# EAGLE design motion_game (EAGLE 8.6.0)
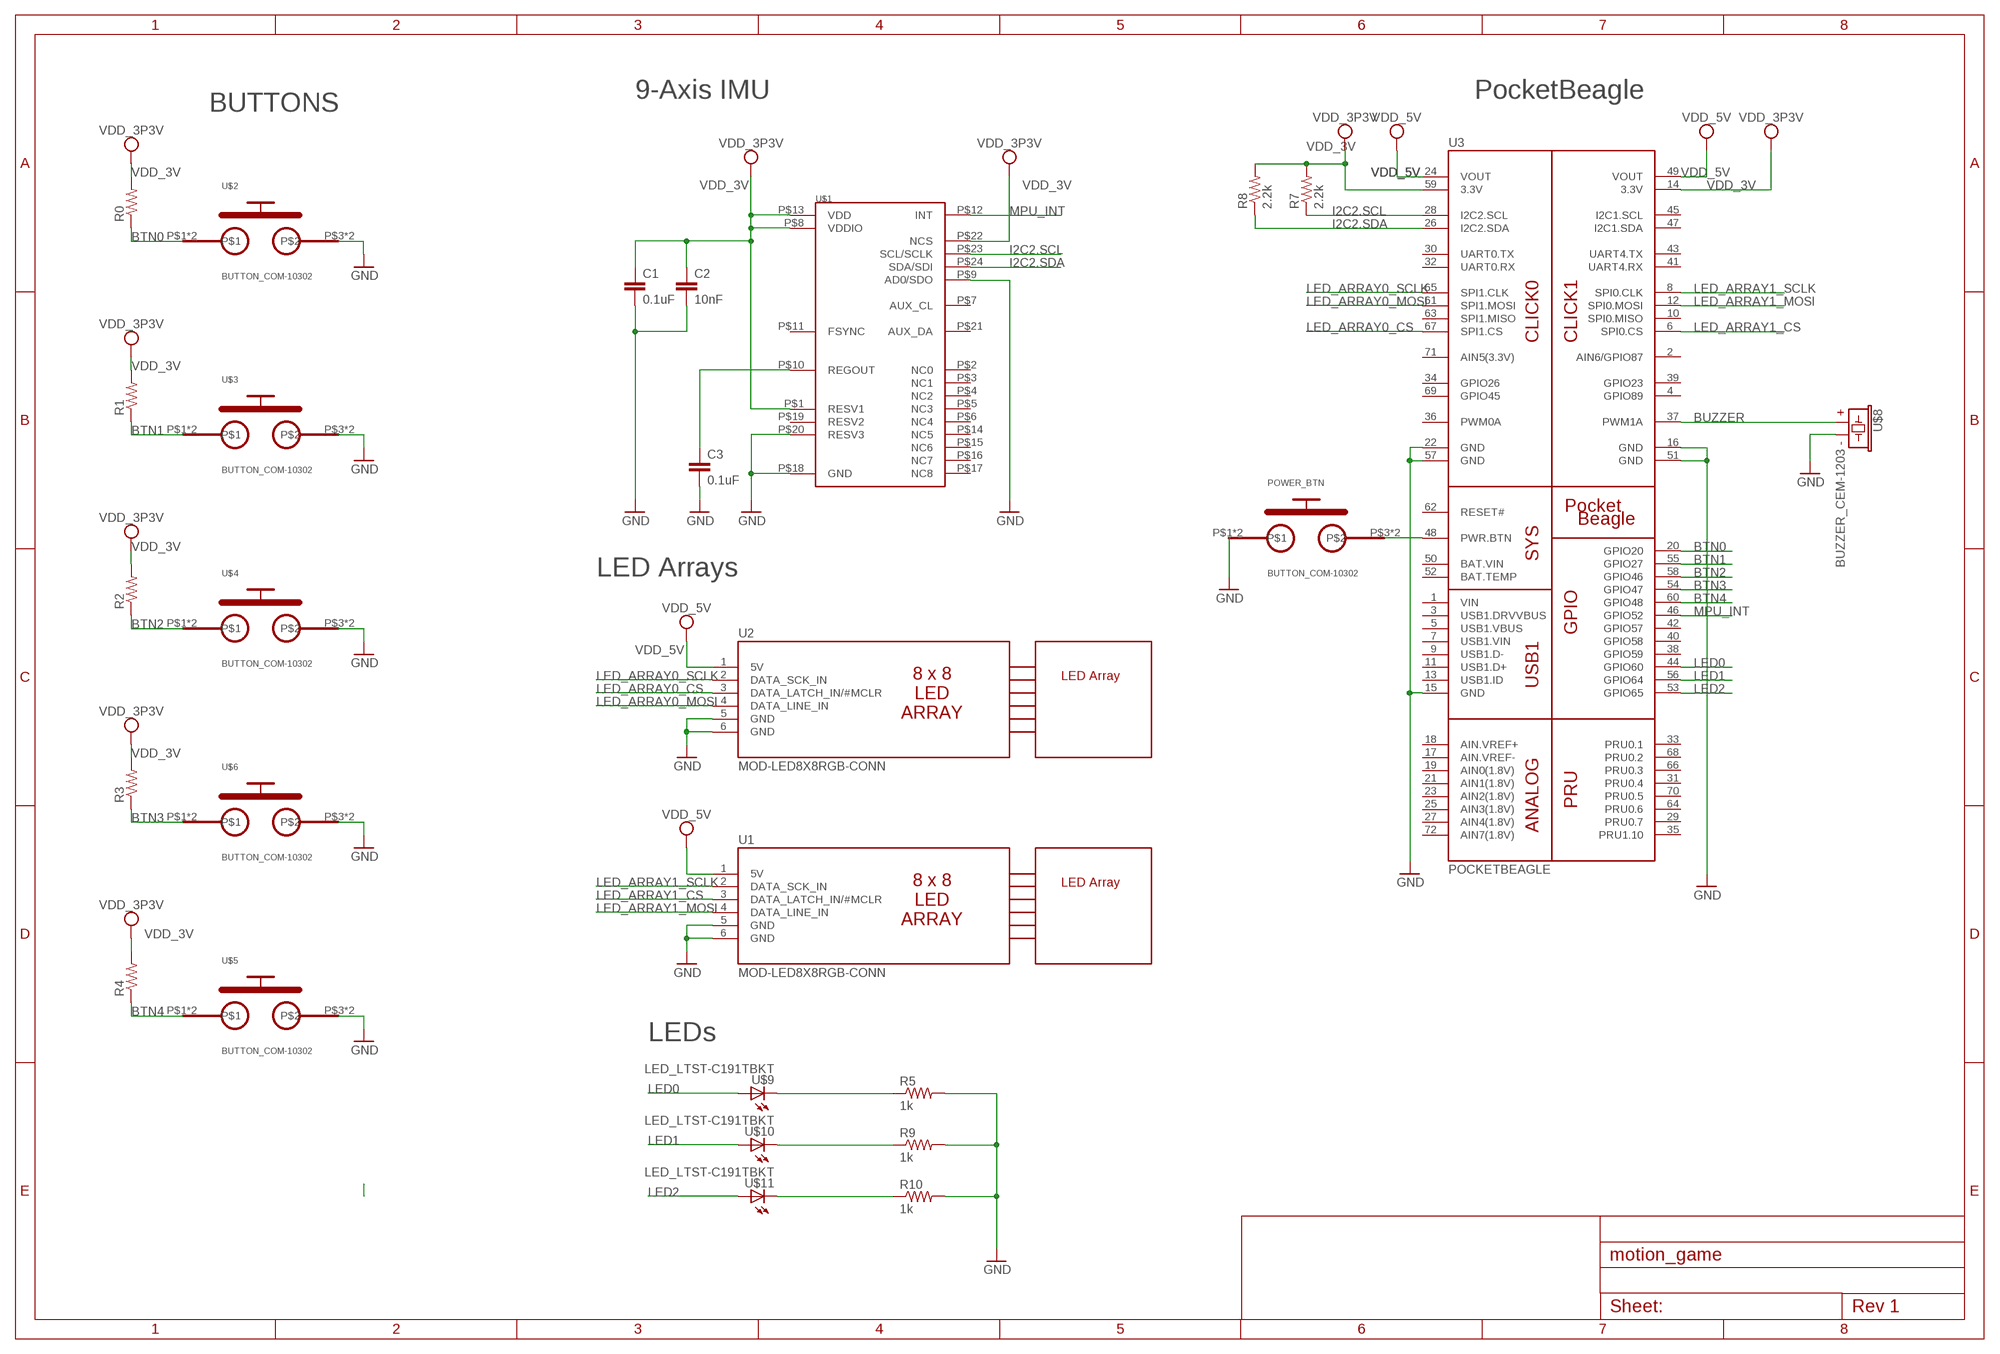
[diagram p0: schematic, sheet 1]

## Parts
C1  0.1uF  C_C0402  [C0402]
C2  10nF  C_C0402  [C0402]
C3  0.1uF  C_C0402  [C0402]
POWER_BTN  BUTTON_COM-10302  [BUTTON_12.5MM]
R0  R_R0603  [R0603]
R1  R_R0603  [R0603]
R2  R_R0603  [R0603]
R3  R_R0603  [R0603]
R4  R_R0603  [R0603]
R5  1k  R_R0603  [R0603]
R7  2.2k  R_R0603  [R0603]
R8  2.2k  R_R0603  [R0603]
R9  1k  R_R0603  [R0603]
R10  1k  R_R0603  [R0603]
U1  MOD-LED8X8RGB-CONN  [FE06W]
U2  MOD-LED8X8RGB-CONN  [FE06W]
U3  POCKETBEAGLE  [POCKETBEAGLE]
U$1  MPU-9250  [QFN3X3MM]
U$2  BUTTON_COM-10302  [BUTTON_12.5MM]
U$3  BUTTON_COM-10302  [BUTTON_12.5MM]
U$4  BUTTON_COM-10302  [BUTTON_12.5MM]
U$5  BUTTON_COM-10302  [BUTTON_12.5MM]
U$6  BUTTON_COM-10302  [BUTTON_12.5MM]
U$7  MOD-LED8X8RGB-OUTLINE  [MOD-LED8X8RGB]
U$8  BUZZER_CEM-1203  [BUZZER_6.5MM]
U$9  LED_LTST-C191TBKT  [LED_EIA-STD]
U$10  LED_LTST-C191TBKT  [LED_EIA-STD]
U$11  LED_LTST-C191TBKT  [LED_EIA-STD]
U$12  MOD-LED8X8RGB-OUTLINE  [MOD-LED8X8RGB]

## Nets
BTN0: R0.1 U3.20(GPIO20) U$2.P$1 U$2.P$2
BTN1: R1.1 U3.55(GPIO27) U$3.P$1 U$3.P$2
BTN2: R2.1 U3.58(GPIO46) U$4.P$1 U$4.P$2
BTN3: R3.1 U3.54(GPIO47) U$6.P$1 U$6.P$2
BTN4: R4.1 U3.60(GPIO48) U$5.P$1 U$5.P$2
BUZZER: U3.37(PWM1A) U$8.P$2
GND: C1.2 C2.2 C3.2 POWER_BTN.P$1 POWER_BTN.P$2 R5.2 R9.2 R10.2 U1.5(GND) U1.6(GND) U2.5(GND) U2.6(GND) U3.15(GND) U3.16(GND) U3.22(GND) U3.51(GND) U3.57(GND) U$1.P$9(AD0/SDO) U$1.P$18(GND) U$1.P$20(RESV3) U$2.P$3 U$2.P$4 U$3.P$3 U$3.P$4 U$4.P$3 U$4.P$4 U$5.P$3 U$5.P$4 U$6.P$3 U$6.P$4 U$8.P$1
I2C2.SCL: R7.1 U3.28(I2C2.SCL) U$1.P$23(SCL/SCLK)
I2C2.SDA: R8.1 U3.26(I2C2.SDA) U$1.P$24(SDA/SDI)
LED0: U3.44(GPIO60) U$9.P$1(A)
LED1: U3.56(GPIO64) U$10.P$1(A)
LED2: U3.53(GPIO65) U$11.P$1(A)
LED_ARRAY0_CS: U2.3(DATA_LATCH_IN/#MCLR) U3.67(SPI1.CS)
LED_ARRAY0_MOSI: U2.4(DATA_LINE_IN) U3.61(SPI1.MOSI)
LED_ARRAY0_SCLK: U2.2(DATA_SCK_IN) U3.65(SPI1.CLK)
LED_ARRAY1_CS: U1.3(DATA_LATCH_IN/#MCLR) U3.6(SPI0.CS)
LED_ARRAY1_MOSI: U1.4(DATA_LINE_IN) U3.12(SPI0.MOSI)
LED_ARRAY1_SCLK: U1.2(DATA_SCK_IN) U3.8(SPI0.CLK)
MPU_INT: U3.46(GPIO52) U$1.P$12(INT)
N$6: R5.1 U$9.P$2(C)
N$10: POWER_BTN.P$3 POWER_BTN.P$4 U3.48(PWR.BTN)
N$13: C3.1 U$1.P$10(REGOUT)
N$36: R9.1 U$10.P$2(C)
N$37: R10.1 U$11.P$2(C)
VDD_3V: C1.1 C2.1 R0.2 R1.2 R2.2 R3.2 R4.2 R7.2 R8.2 U3.14(3.3V) U3.59(3.3V) U$1.P$1(RESV1) U$1.P$8(VDDIO) U$1.P$13(VDD) U$1.P$22(NCS) ; supply symbol labelled VDD_3P3V
VDD_5V: U1.1(5V) U2.1(5V) U3.24(VOUT) U3.49(VOUT)
Unconnected: U3.1(VIN) U3.2(AIN6/GPIO87) U3.3(USB1.DRVVBUS) U3.4(GPIO89) U3.5(USB1.VBUS) U3.7(USB1.VIN) U3.9(USB1.D-) U3.10(SPI0.MISO) U3.11(USB1.D+) U3.13(USB1.ID) U3.17(AIN.VREF-) U3.18(AIN.VREF+) U3.19(AIN0(1.8V)) U3.21(AIN1(1.8V)) U3.23(AIN2(1.8V)) U3.25(AIN3(1.8V)) U3.27(AIN4(1.8V)) U3.29(PRU0.7) U3.30(UART0.TX) U3.31(PRU0.4) U3.32(UART0.RX) U3.33(PRU0.1) U3.34(GPIO26) U3.35(PRU1.10) U3.36(PWM0A) U3.38(GPIO59) U3.39(GPIO23) U3.40(GPIO58) U3.41(UART4.RX) U3.42(GPIO57) U3.43(UART4.TX) U3.45(I2C1.SCL) U3.47(I2C1.SDA) U3.50(BAT.VIN) U3.52(BAT.TEMP) U3.62(RESET#) U3.63(SPI1.MISO) U3.64(PRU0.6) U3.66(PRU0.3) U3.68(PRU0.2) U3.69(GPIO45) U3.70(PRU0.5) U3.71(AIN5(3.3V)) U3.72(AIN7(1.8V)) U$1.P$2(NC0) U$1.P$3(NC1) U$1.P$4(NC2) U$1.P$5(NC3) U$1.P$6(NC4) U$1.P$7(AUX_CL) U$1.P$11(FSYNC) U$1.P$14(NC5) U$1.P$15(NC6) U$1.P$16(NC7) U$1.P$17(NC8) U$1.P$19(RESV2) U$1.P$21(AUX_DA)

## Notes on the sheet
- 9-Axis IMU | PocketBeagle
- BUTTONS
- LED Arrays
- LEDs

## Library data of the parts
C1-C3 = motion_game:C_: Capacitor SMD. Sizes: 0402, 0603 & 0805
POWER_BTN U$2-U$6 = motion_game:BUTTON_COM-10302
R0 R1-R4 R7 R8 = motion_game:R_: RESISTOR, American symbol
R5 R9 R10 = Maze_game:R_: RESISTOR, American symbol
U1 U2 = ENGI301_Maze_Project_Parts:MOD-LED8X8RGB-CONN
U3 = motion_game:POCKETBEAGLE
U$1 = motion_game:MPU-9250: MPU-9250 9-axis IMU
U$7 U$12 = Maze_game:MOD-LED8X8RGB-OUTLINE
U$8 = Maze_game:BUZZER_CEM-1203
U$9-U$11 = motion_game:LED_LTST-C191TBKT

## Board
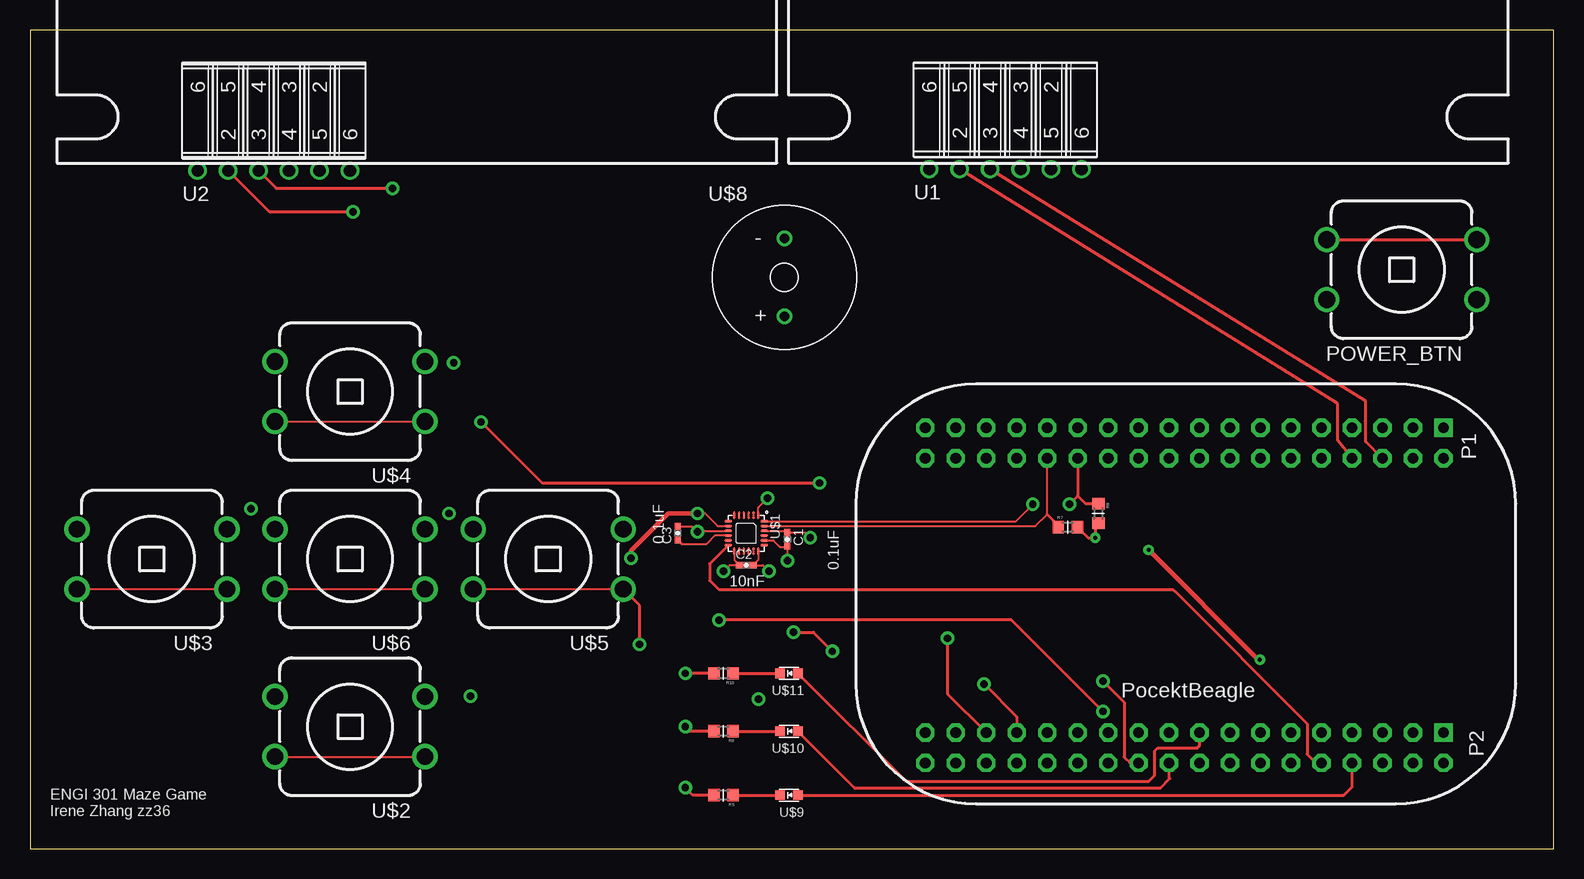
[diagram p1: board, top side]
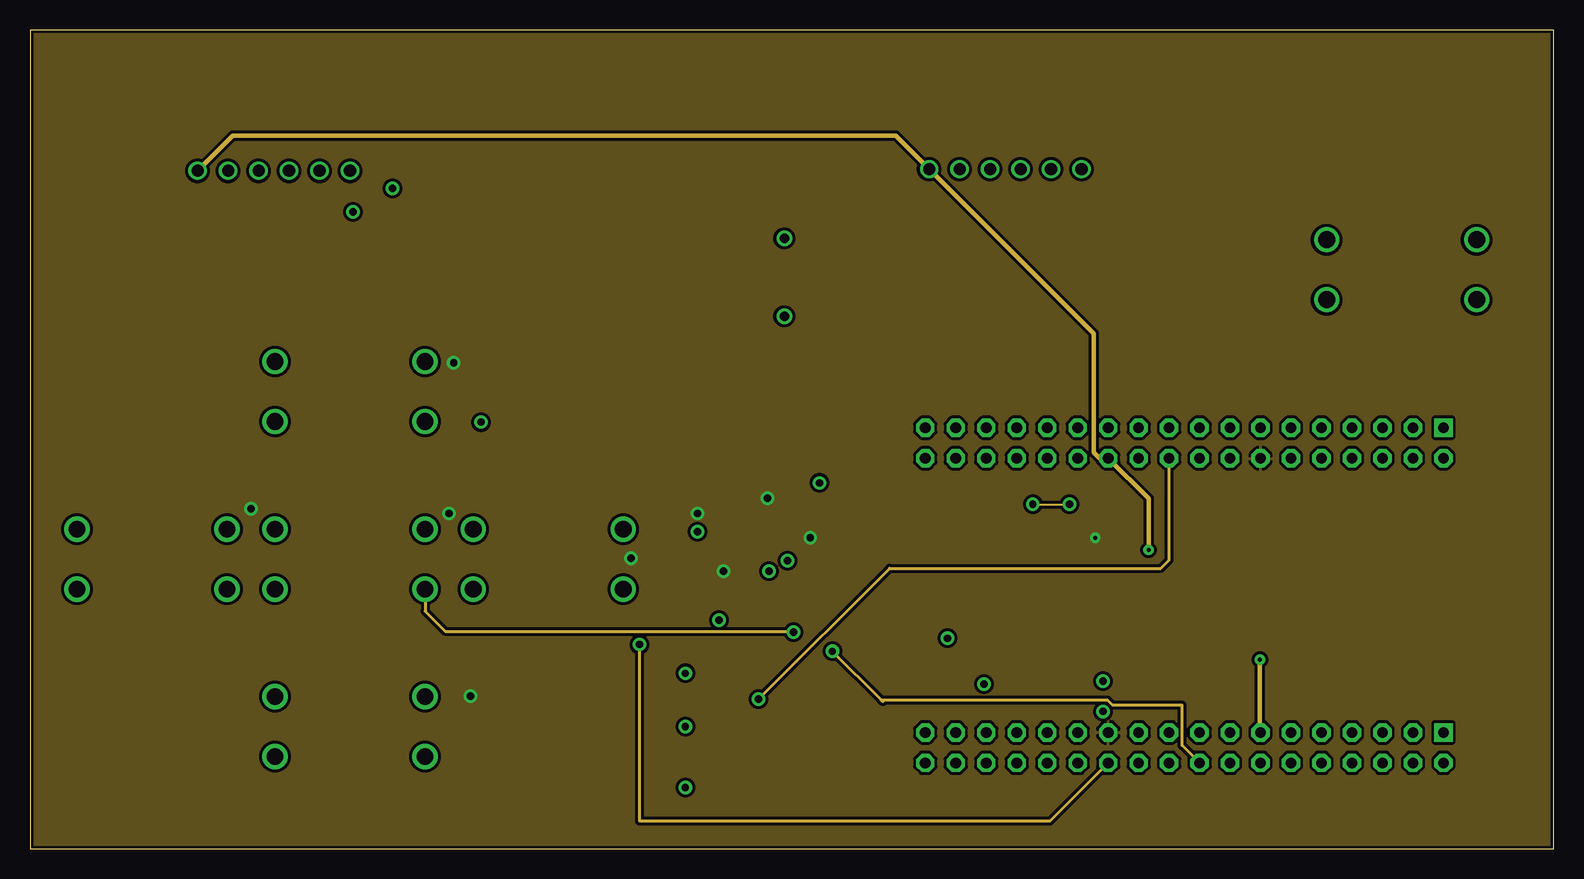
[diagram p2: board, inner layer Route2]
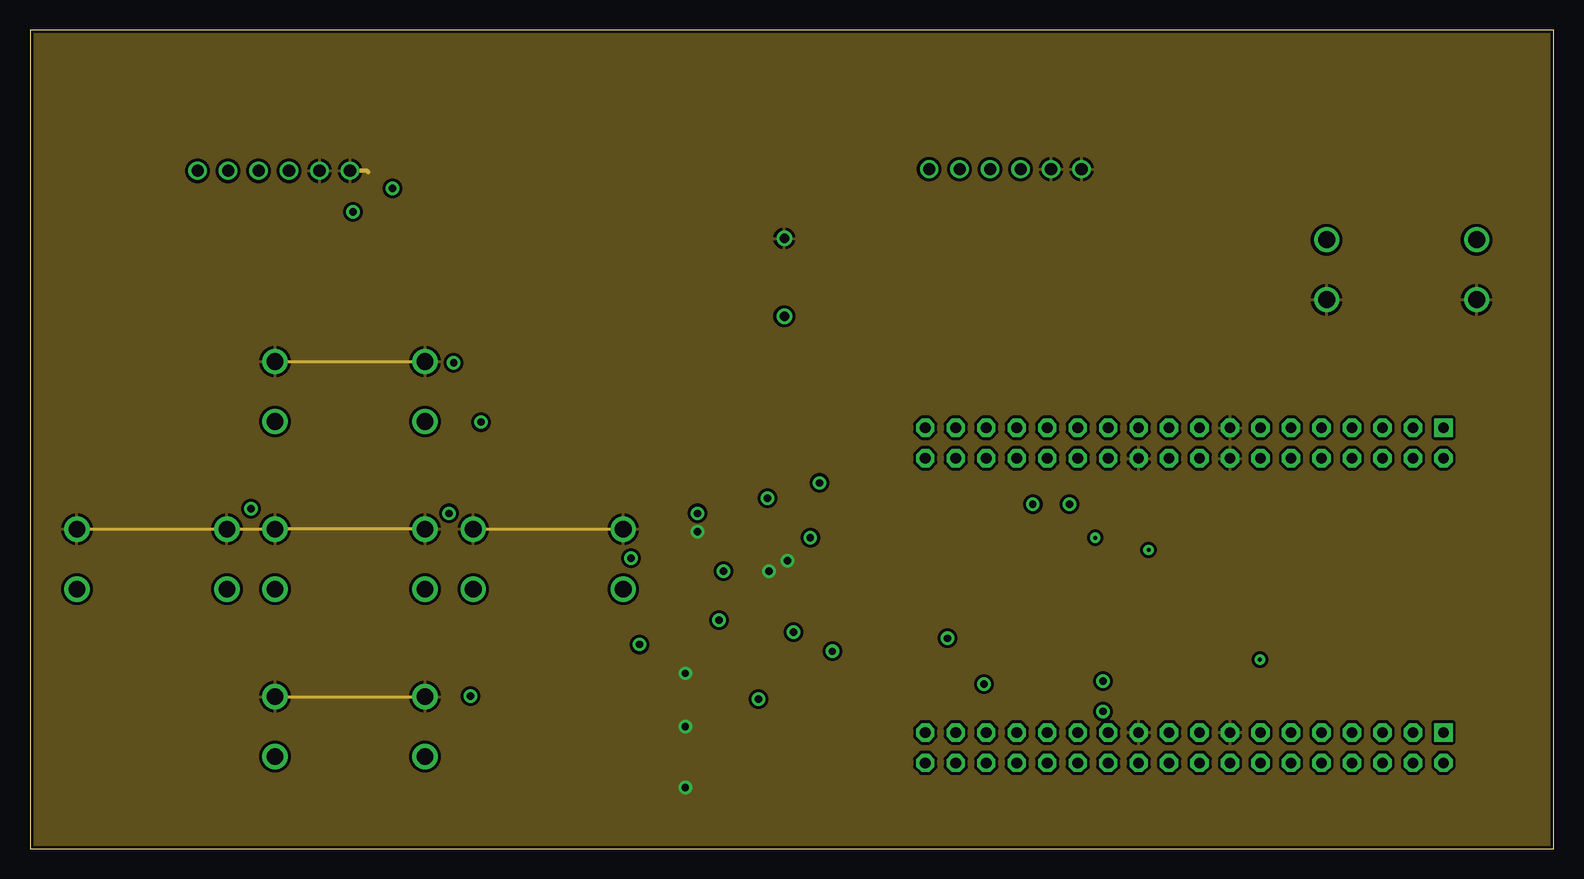
[diagram p3: board, inner layer Route15]
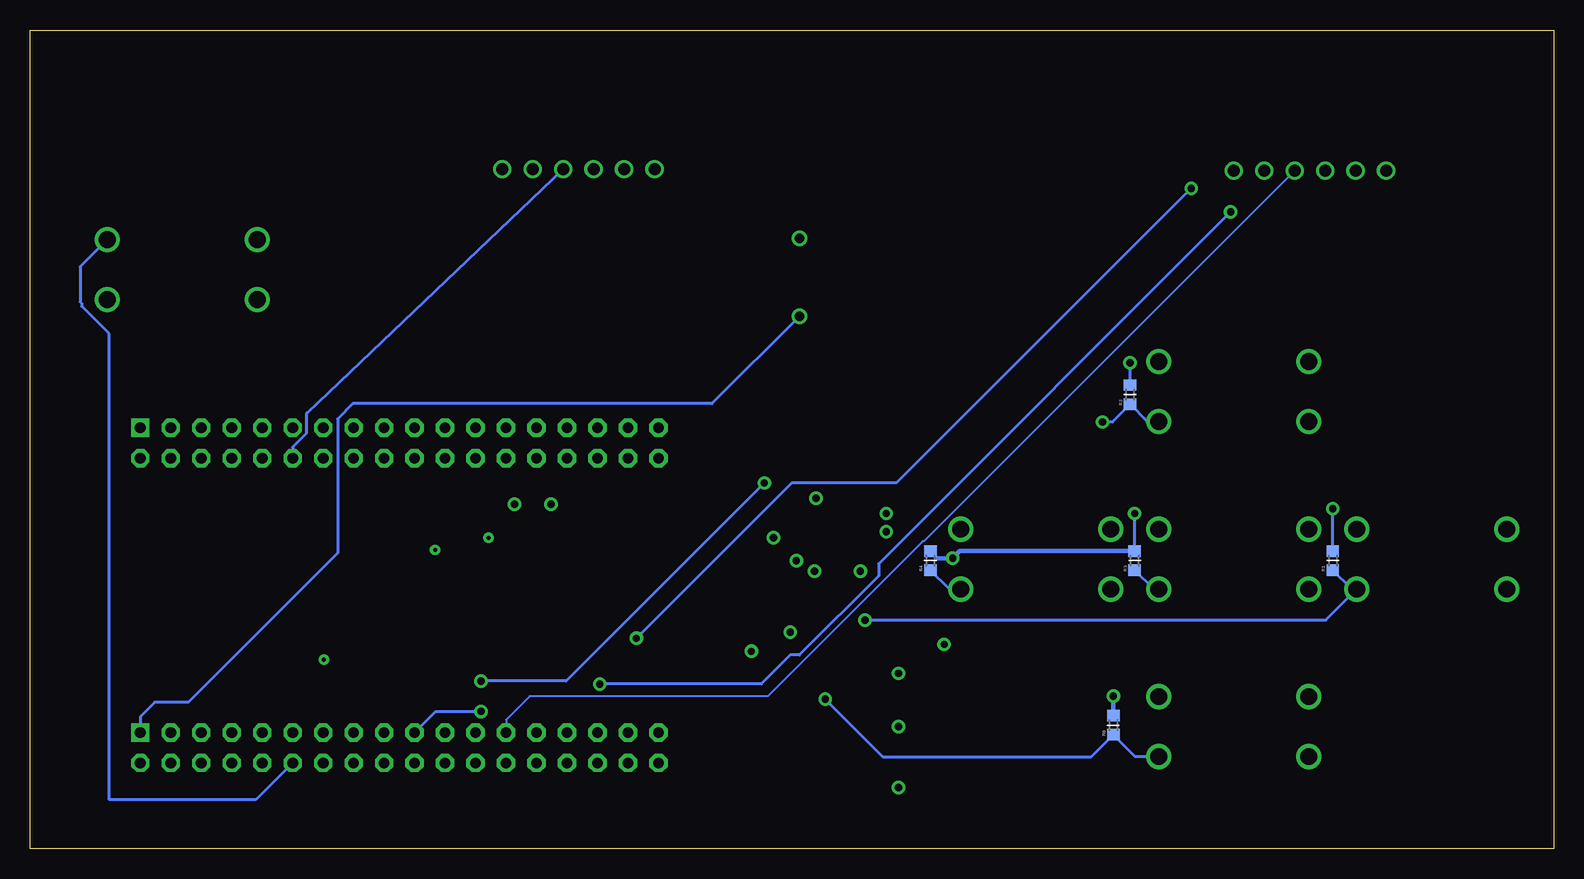
[diagram p4: board, bottom side, seen from below]

Size 126.98 x 68.25 mm. Coordinates in mm from the lower left corner, seen from the top.
Outline: 0,0 126.98,0 126.98,68.25 0,68.25 0,0
Copper layers (1*2*15*16): Top 0.035mm / dielectric 0.23mm / Route2 0.035mm / dielectric 0.93mm / Route15 0.035mm / dielectric 0.23mm / Bottom 0.035mm
Design rules "ENGI301_Maze_Project_4lyr": minimum track width 10mil, minimum drill 12mil, track to track 10mil, track to pad 10mil, pad to pad 10mil, via to via 10mil, smd to smd 10mil, copper to edge 10mil, drill to drill 12mil, minimum pad ring 10mil, minimum via ring 10mil, stop-mask expansion 3mil, vias tented up to drill 25mil, thermal gap 10mil

### Footprints (pad centres in the part's own frame; a part is rotated, then mirrored left to right if it is on the bottom)
C0402 = smd 0.61 x 0.508: 1 -0.559,0; 2 0.559,0
BUTTON_12.5MM = drill 1.4: P$1 -6.25,2.5; P$2 6.25,2.5; P$3 -6.25,-2.5; P$4 6.25,-2.5
R0603 = smd 0.95 x 1.031: 1 -0.8,0; 2 0.8,0
FE06W = drill 1.016: 1 -6.35,0; 2 -3.81,0; 3 -1.27,0; 4 1.27,0; 5 3.81,0; 6 6.35,0
POCKETBEAGLE = drill 0.889 pad 1.524 square: 1 5.91,3.53; 37 5.91,28.93 | drill 0.889 pad 1.524 octagon: 2 5.91,6.07; 3 8.45,3.53; 4 8.45,6.07; 5 10.99,3.53; 6 10.99,6.07; 7 13.53,3.53; 8 13.53,6.07; 9 16.07,3.53; 10 16.07,6.07; 11 18.61,3.53; 12 18.61,6.07; 13 21.15,3.53; 14 21.15,6.07; 15 23.69,3.53; 16 23.69,6.07; 17 26.23,3.53; 18 26.23,6.07; 19 28.77,3.53; 20 28.77,6.07; 21 31.31,3.53; 22 31.31,6.07; 23 33.85,3.53; 24 33.85,6.07; 25 36.39,3.53; 26 36.39,6.07; 27 38.93,3.53; 28 38.93,6.07; 29 41.47,3.53; 30 41.47,6.07; 31 44.01,3.53; 32 44.01,6.07; 33 46.55,3.53; 34 46.55,6.07; 35 49.09,3.53; 36 49.09,6.07; 38 5.91,31.47; 39 8.45,28.93; 40 8.45,31.47; 41 10.99,28.93; 42 10.99,31.47; 43 13.53,28.93; 44 13.53,31.47; 45 16.07,28.93; 46 16.07,31.47; 47 18.61,28.93; 48 18.61,31.47; 49 21.15,28.93; 50 21.15,31.47; 51 23.69,28.93; 52 23.69,31.47; 53 26.23,28.93; 54 26.23,31.47; 55 28.77,28.93; 56 28.77,31.47; 57 31.31,28.93; 58 31.31,31.47; 59 33.85,28.93; 60 33.85,31.47; 61 36.39,28.93; 62 36.39,31.47; 63 38.93,28.93; 64 38.93,31.47; 65 41.47,28.93; 66 41.47,31.47; 67 44.01,28.93; 68 44.01,31.47; 69 46.55,28.93; 70 46.55,31.47; 71 49.09,28.93; 72 49.09,31.47
QFN3X3MM = smd 0.6 x 0.2: P$1 -1.5,1; P$2 -1.5,0.6; P$3 -1.5,0.2; P$4 -1.5,-0.2; P$5 -1.5,-0.6; P$6 -1.5,-1; P$13 1.5,-1; P$14 1.5,-0.6; P$15 1.5,-0.2; P$16 1.5,0.2; P$17 1.5,0.6; P$18 1.5,1 | smd 0.2 x 0.6: P$7 -1,-1.5; P$8 -0.6,-1.5; P$9 -0.2,-1.5; P$10 0.2,-1.5; P$11 0.6,-1.5; P$12 1,-1.5; P$19 1,1.5; P$20 0.6,1.5; P$21 0.2,1.5; P$22 -0.2,1.5; P$23 -0.6,1.5; P$24 -1,1.5
BUZZER_6.5MM = drill 0.8: P$1 0,3.25; P$2 0,-3.25
LED_EIA-STD = smd 0.8 x 0.8: P$1 -0.75,0; P$2 0.75,0

### Placement (x,y rotation side)
C1  63.12,25.78 270 top
C2  59.69,23.62 0 top
C3  53.98,26.29 90 top
POWER_BTN  114.3,48.26 180 top
R0  36.7,10.29 90 bottom
R1  18.41,24 90 bottom
R2  35.31,37.85 90 bottom
R3  34.92,24 90 bottom
R4  51.94,24 90 bottom
R5  57.78,4.45 180 top
R7  86.49,26.8 0 top
R8  89.03,27.94 270 top
R9  57.78,9.78 180 top
R10  57.78,14.61 180 top
U1  81.28,56.64 0 top
U2  20.32,56.52 0 top
U3  123.7,38.61 180 top
U$1  59.69,26.29 270 top
U$2  26.67,10.16 180 top
U$3  10.16,24.13 180 top
U$4  26.67,38.1 180 top
U$5  43.18,24.13 180 top
U$6  26.67,24.13 180 top
U$7  62.23,57.15 90 top
U$8  62.87,47.62 0 top
U$9  63.25,4.45 180 top
U$10  63.25,9.78 180 top
U$11  63.25,14.61 180 top
U$12  123.19,57.15 90 top

### Tracks (layer width: path | path; a pad name or v marks a point on that pad's centre or on a via)
BTN0  (via drill 0.61)
  Top 0.178: U$2.P$2 U$2.P$1
  Route2 0.254: v60.71,12.45 71.63,23.37 94.23,23.37 94.93,24.06 U3.20
  Bottom 0.254: U$2.P$1 34.88,7.66 R0.1 38.57,7.62 55.88,7.62 v60.71,12.45
BTN1  (via drill 0.61)
  Top 0.178: U$3.P$2 U$3.P$1
  Top 0.254: v89.41,11.43 81.79,19.05 v57.4,19.05
  Bottom 0.254: R1.1 16.84,21.63 U$3.P$1 18.99,19.05 v57.4,19.05 | U3.55 93.18,11.43 v89.41,11.43
BTN2  (via drill 0.61)
  Top 0.178: U$4.P$2 U$4.P$1
  Top 0.254: v37.59,35.56 42.67,30.48 v65.79,30.48 | v89.41,13.97 91.19,12.19 91.19,7.62 91.67,7.14 U3.58
  Bottom 0.254: U$4.P$1 33.86,35.6 R2.1 36.79,35.56 v37.59,35.56 | v65.79,30.48 82.3,13.97 v89.41,13.97
BTN3  (via drill 0.6)
  Top 0.178: U$6.P$2 U$6.P$1
  Top 0.254: v63.63,18.03 65.28,18.03 v66.86,16.45
  Route2 0.254: U3.54 96.01,8.59 96.01,11.94 90.23,11.94 89.8,12.37 70.94,12.37 | 71.07,12.24 70.94,12.37 | 66.55,16.76 v66.86,16.45 70.93,12.38 70.94,12.37 | U$6.P$1 32.92,19.79 34.59,18.11 63.55,18.11 v63.63,18.03
  Bottom 0.254: U$6.P$1 33.35,21.63 R3.1
BTN4  (via drill 0.61)
  Top 0.178: U$5.P$2 U$5.P$1
  Top 0.254: v50.8,17.02 50.8,20.26 U$5.P$1
  Route2 0.254: U3.60 85,2.29 50.8,2.29 v50.8,17.02
  Bottom 0.254: U$5.P$1 50.37,21.63 R4.1
BUZZER
  Bottom 0.254: U$8.P$2 70.16,37.08 100.08,37.08 101.35,35.81 101.35,24.64 113.79,12.19 116.59,12.19 117.79,10.99 U3.37
GND  (via drill 0.61)
  Top 0.178: U$1.P$9 56.21,26.49 56.13,26.42 v55.63,26.42 55.19,26.85 C3.2 | U$1.P$20 61.94,25.69 62.48,25.15 63.04,25.15 C1.2 v63.12,24 | U$1.P$18 60.69,24.06 C2.2 61.09,23.62 v61.59,23.11
  Top 0.254: R10.2 v54.61,14.61 | R5.2 55.24,4.45 v54.61,5.08 | R9.2 54.99,9.78 v54.61,10.16
  Route15 0.254: U$6.P$3 U$6.P$4 U$3.P$3 U$3.P$4 | U$4.P$4 U$4.P$3 | U$2.P$4 U$2.P$3 | U$5.P$4 U$5.P$3
  Route15 0.381: U2.6 28.07,56.52 28.19,56.39
  pour Route15: -1.27,71.12 128.78,71.12 128.78,-1.27 -1.27,-1.27
I2C2.SCL
  Top 0.178: U$1.P$23 83.78,26.89 84.77,27.87 U3.28
  Top 0.254: 84.77,27.87 85.69,26.95 R7.1
I2C2.SDA  (via drill 0.61)
  Top 0.178: U$1.P$24 82.15,27.29 v83.57,28.7 | 86.68,28.77 v86.61,28.7 | 87.94,28.76 87.96,28.74
  Top 0.254: R8.1 89.01,28.76 87.94,28.76 87.31,29.4 | U3.26 87.31,29.4 | 87.31,29.4 86.68,28.77
  Route2 0.178: v83.57,28.7 v86.61,28.7
LED0
  Top 0.254: U$9.P$1 109.47,4.45 110.17,5.14 U3.44
LED1
  Top 0.254: U$10.P$1 68.69,5.08 94.23,5.08 95,5.84 94.93,5.91 U3.56
LED2
  Top 0.254: U$11.P$1 73.01,5.59 93.22,5.59 93.73,6.1 93.73,8.13 93.98,8.38 97.28,8.38 97.47,8.57 U3.53
LED_ARRAY0_CS  (via drill 0.61)
  Top 0.254: U2.3 20.51,55.05 v30.21,55.05 | v76.45,17.53 76.45,12.91 U3.67
  Bottom 0.254: v30.21,55.05 54.78,30.48 63.5,30.48 v76.45,17.53
LED_ARRAY0_MOSI
  Bottom 0.178: U2.4 52.48,25.62 52.6,25.62 65.52,12.7 85.34,12.7 87.31,10.74 U3.61
LED_ARRAY0_SCLK  (via drill 0.61)
  Top 0.254: U2.2 19.94,53.09 v26.92,53.09 | v79.5,13.72 82.23,10.99 U3.65
  Bottom 0.254: v79.5,13.72 66.04,13.72 63.63,16.13 62.87,16.13 56.26,22.73 56.26,23.75 v26.92,53.09
LED_ARRAY1_CS
  Top 0.254: U3.6 111.31,33.94 111.31,35.55 111.25,35.61 111.25,37.34 U1.3
LED_ARRAY1_MOSI
  Bottom 0.254: U1.4 103.89,36.32 103.94,36.26 103.94,34.6 105.09,33.46 U3.12
LED_ARRAY1_SCLK
  Top 0.254: U3.8 108.97,34.04 108.97,37.08 U1.2
MPU_INT
  Top 0.178: 95.25,21.59 95.38,21.46 | U$1.P$12 58.04,25.14
  Top 0.254: U3.46 107.16,7.14 106.43,7.87 106.43,10.41 95.38,21.46 | 58.04,25.14 56.64,23.74 56.64,22.35 57.4,21.59 95.25,21.59
N$6
  Top 0.254: R5.1 U$9.P$2
N$10
  Top 0.254: POWER_BTN.P$4 POWER_BTN.P$3
  Bottom 0.152: 122.81,45.59 122.68,45.47
  Bottom 0.254: POWER_BTN.P$3 122.81,48.5 122.81,45.59 | 122.68,45.47 122.68,45.21 120.4,42.93 120.4,4.06 108.16,4.06 U3.48
N$13
  Top 0.178: U$1.P$10 57.08,26.09 56.38,25.39 54.31,25.39
  Top 0.254: C3.1 54.31,25.39
N$36
  Top 0.254: R9.1 U$10.P$2
N$37
  Top 0.254: R10.1 U$11.P$2
VDD_3V  (via drill 0.35, 0.61)
  Top 0.178: U$1.P$1 60.69,28.43 v61.47,29.21 | U$1.P$13 58.69,24.06 C2.1 58.29,23.62 v57.78,23.11 | v65.02,25.91 64.59,26.34 C1.1 62.97,26.49 U$1.P$22 | v55.63,27.94 56.26,27.94 57.31,26.89 U$1.P$8 | 53.19,27.94 52.69,27.44
  Top 0.254: 52.78,27.53 52.69,27.44 | R7.2 88.18,25.91 v88.77,25.91 88.77,26.89 R8.2 | 62.97,26.42 63.04,26.42 C1.1
  Top 0.381: v55.63,27.94 53.19,27.94 50.09,24.84 v50.09,24.2
  Route2 0.254: v88.77,25.91 88.9,25.91
  Bottom 0.254: R1.2 v18.41,28.32 | R3.2 v34.92,27.94 | R2.2 v35.31,40.51 | 51.34,24.2 R4.2
  Bottom 0.381: v36.7,12.7 R0.2 | R3.2 49.49,24.8 v50.09,24.2 51.34,24.2
  pour Route2: -2.54,72.39 130.81,72.39 130.81,-2.54 -2.54,-2.54
VDD_5V  (via drill 0.35)
  Top 0.381: v93.22,24.89 102.36,15.75 v102.49,15.75
  Route2 0.381: U2.1 16.89,59.44 72.14,59.44 U1.1 88.65,42.93 88.65,33.02 89.13,32.54 U3.24 93.22,29.17 v93.22,24.89 | v102.49,15.75 102.49,9.74 U3.49

### Text on the board
tPlace: 0.1uF | 10nF | 0.1uF | ENGI 301 Maze Game / Irene Zhang zz36